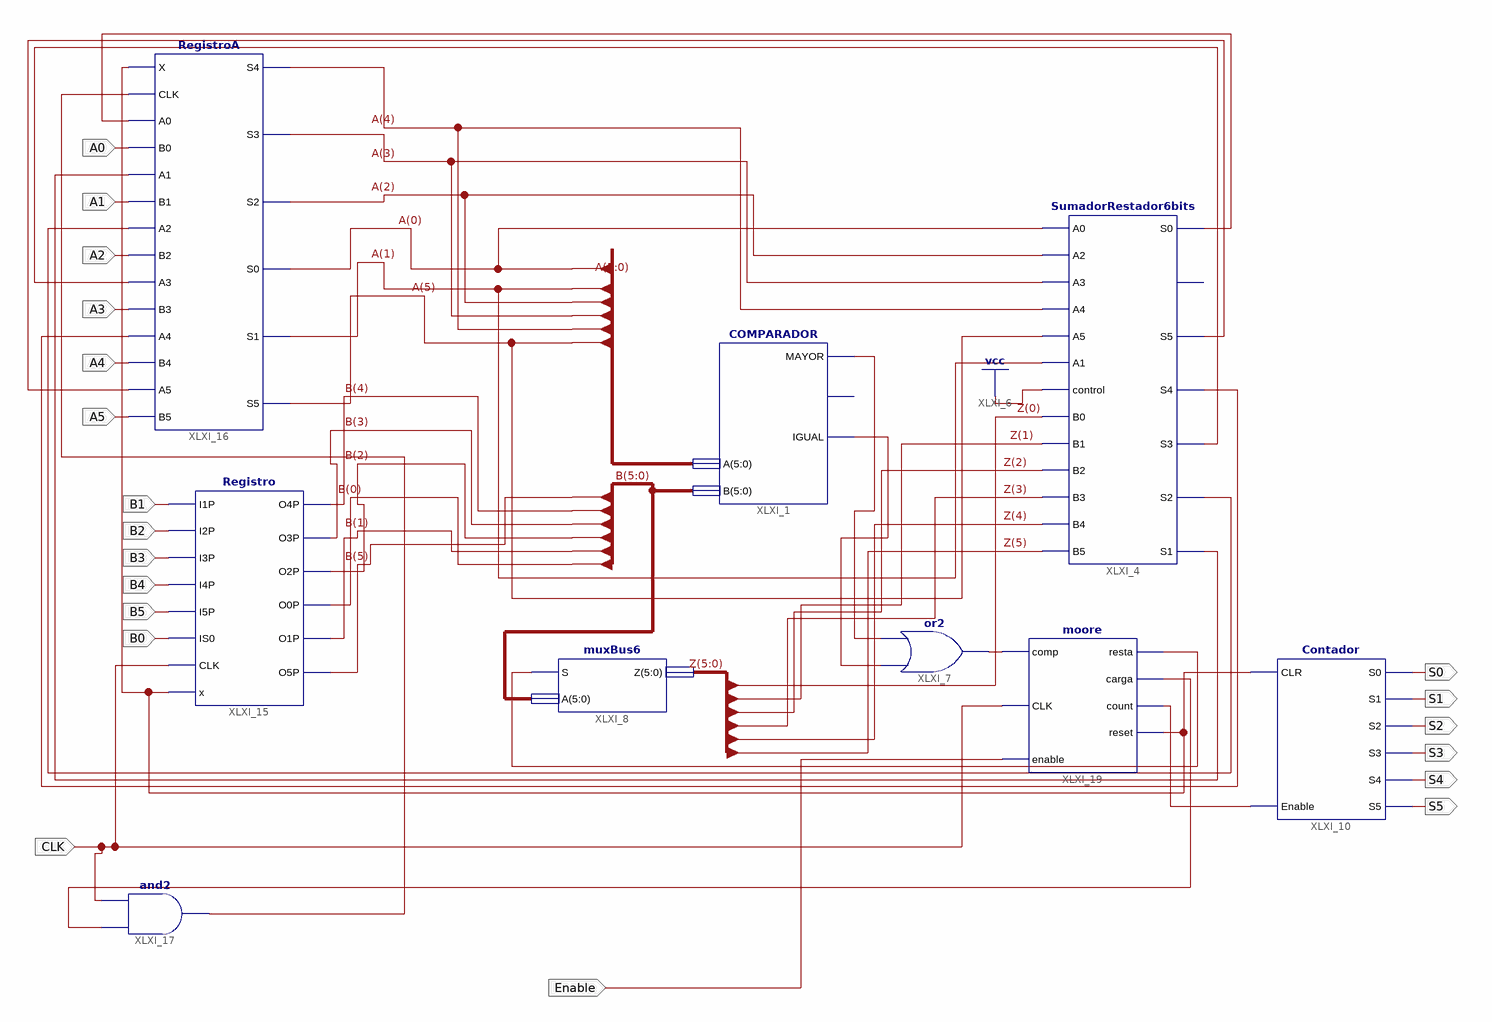
[diagram p0: schematic sheet 1]
// Xilinx ISE schematic Division.sch (spartan3e) as structural Verilog: 9 symbols, 20 ports
module Division (
  input  A0,
  input  A2,
  input  A5,
  input  A1,
  input  A3,
  input  A4,
  input  CLK,
  input  Enable,
  input  B1,
  input  B2,
  input  B3,
  input  B4,
  input  B5,
  input  B0,
  output S0,
  output S1,
  output S2,
  output S3,
  output S4,
  output S5
);

  wire XLXN_26, XLXN_31, XLXN_46, XLXN_47, XLXN_49, XLXN_70, XLXN_77, XLXN_78, XLXN_79, XLXN_80, XLXN_82,
       XLXN_83, XLXN_94, XLXN_95;
  wire [5:0] A, B, Z;

  COMPARADOR XLXI_1 (.A(A), .B(B), .MAYOR(XLXN_46), .IGUAL(XLXN_47));  // open: MENOR
  SumadorRestador6bits XLXI_4 (
    .A0(A[0]), .A2(A[2]), .A3(A[3]), .A4(A[4]), .A5(A[5]), .A1(A[1]), .control(1'b1), .B0(Z[0]), .B1(Z[1]),
    .B2(Z[2]), .B3(Z[3]), .B4(Z[4]), .B5(Z[5]), .S0(XLXN_77), .S5(XLXN_78), .S4(XLXN_79), .S3(XLXN_80),
    .S2(XLXN_82), .S1(XLXN_83));  // open: cout
  or XLXI_7 (XLXN_26, XLXN_47, XLXN_46);
  muxBus6 XLXI_8 (.S(XLXN_31), .A(B), .Z(Z));
  Contador XLXI_10 (.CLR(XLXN_70), .Enable(XLXN_49), .S0(S0), .S1(S1), .S2(S2), .S3(S3), .S4(S4), .S5(S5));
  Registro XLXI_15 (
    .I1P(B1), .I2P(B2), .I3P(B3), .I4P(B4), .I5P(B5), .IS0(B0), .CLK(CLK), .x(XLXN_70), .O4P(B[4]),
    .O3P(B[3]), .O2P(B[2]), .O0P(B[0]), .O1P(B[1]), .O5P(B[5]));
  RegistroA XLXI_16 (
    .X(XLXN_70), .CLK(XLXN_94), .A0(XLXN_77), .B0(A0), .A1(XLXN_83), .B1(A1), .A2(XLXN_82), .B2(A2),
    .A3(XLXN_80), .B3(A3), .A4(XLXN_79), .B4(A4), .A5(XLXN_78), .B5(A5), .S4(A[4]), .S3(A[3]), .S2(A[2]),
    .S0(A[0]), .S1(A[1]), .S5(A[5]));
  and XLXI_17 (XLXN_94, XLXN_95, CLK);
  moore XLXI_19 (
    .comp(XLXN_26), .CLK(CLK), .resta(XLXN_31), .carga(XLXN_95), .count(XLXN_49), .reset(XLXN_70),
    .enable(Enable));
endmodule
